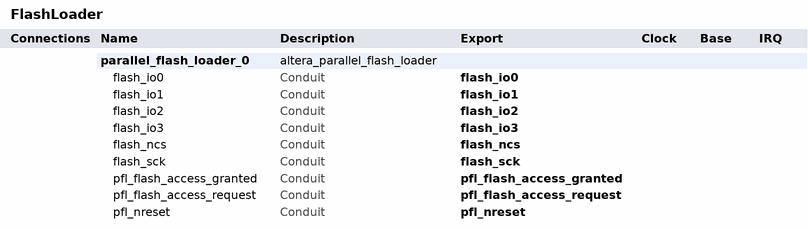
[diagram p0: system contents]
# Platform Designer (Qsys) system FlashLoader, MAX 10 10M04SCE144C8G
# Parameters at their usual value, and those the tool derives, are not listed.
package require -exact qsys 15.0
create_system FlashLoader
set_project_property DEVICE_FAMILY {MAX 10}
set_project_property DEVICE 10M04SCE144C8G

add_instance parallel_flash_loader_0 altera_parallel_flash_loader 15.0
set_instance_property parallel_flash_loader_0 AUTO_EXPORT true
set_instance_parameter_value parallel_flash_loader_0 FLASH_ECC_CHECKBOX false
set_instance_parameter_value parallel_flash_loader_0 QFLASH_FAST_SPEED false
set_instance_parameter_value parallel_flash_loader_0 TRISTATE_CHECKBOX false
set_instance_parameter_value parallel_flash_loader_0 clock_frequency 100.0
set_instance_parameter_value parallel_flash_loader_0 dclk_divisor_combo 1
set_instance_parameter_value parallel_flash_loader_0 decompressor_combo None
set_instance_parameter_value parallel_flash_loader_0 disable_crc_check true
set_instance_parameter_value parallel_flash_loader_0 enhanced_flash_programming_combo Area
set_instance_parameter_value parallel_flash_loader_0 fifo_size_combo 16
set_instance_parameter_value parallel_flash_loader_0 flash_access_time 100
set_instance_parameter_value parallel_flash_loader_0 flash_data_width_combo {16 bits}
set_instance_parameter_value parallel_flash_loader_0 flash_device_combo {CFI 8 Mbit}
set_instance_parameter_value parallel_flash_loader_0 flash_nreset_check false
set_instance_parameter_value parallel_flash_loader_0 flash_type_combo {Quad SPI Flash}
set_instance_parameter_value parallel_flash_loader_0 fpga_conf_scheme_combo {PS (passive serial)}
set_instance_parameter_value parallel_flash_loader_0 nflash_access_time 100
set_instance_parameter_value parallel_flash_loader_0 nflash_data_width_combo {8 bits}
set_instance_parameter_value parallel_flash_loader_0 nflash_device_combo {NAND 512 Mbit}
set_instance_parameter_value parallel_flash_loader_0 nflash_mfc_combo {Micron(NAND)}
set_instance_parameter_value parallel_flash_loader_0 nflash_rb_edit 0
set_instance_parameter_value parallel_flash_loader_0 num_flash_combo 1
set_instance_parameter_value parallel_flash_loader_0 num_nflash_combo 1
set_instance_parameter_value parallel_flash_loader_0 num_qflash_combo 1
set_instance_parameter_value parallel_flash_loader_0 operating_mode_combo {Flash Programming}
set_instance_parameter_value parallel_flash_loader_0 option_bit_address 0
set_instance_parameter_value parallel_flash_loader_0 qflash_mfc_combo Micron
set_instance_parameter_value parallel_flash_loader_0 qflash_size_combo {EPCQ 16 Mbit}
set_instance_parameter_value parallel_flash_loader_0 qspi_size_combo {QSPI 32 Mbit}
set_instance_parameter_value parallel_flash_loader_0 read_modes_combo {Normal Mode}
set_instance_parameter_value parallel_flash_loader_0 reconfigure_checkbox false
set_instance_parameter_value parallel_flash_loader_0 rsu_watchdog_checkbox false
set_instance_parameter_value parallel_flash_loader_0 rsu_watchdog_counter_edit 100.0
set_instance_parameter_value parallel_flash_loader_0 safe_mode_combo Halt
set_instance_parameter_value parallel_flash_loader_0 safe_mode_revert_edit 0

# exported interfaces
add_interface flash_io0 conduit end
set_interface_property flash_io0 EXPORT_OF parallel_flash_loader_0.flash_io0
add_interface flash_io1 conduit end
set_interface_property flash_io1 EXPORT_OF parallel_flash_loader_0.flash_io1
add_interface flash_io2 conduit end
set_interface_property flash_io2 EXPORT_OF parallel_flash_loader_0.flash_io2
add_interface flash_io3 conduit end
set_interface_property flash_io3 EXPORT_OF parallel_flash_loader_0.flash_io3
add_interface flash_ncs conduit end
set_interface_property flash_ncs EXPORT_OF parallel_flash_loader_0.flash_ncs
add_interface flash_sck conduit end
set_interface_property flash_sck EXPORT_OF parallel_flash_loader_0.flash_sck
add_interface pfl_flash_access_granted conduit end
set_interface_property pfl_flash_access_granted EXPORT_OF parallel_flash_loader_0.pfl_flash_access_granted
add_interface pfl_flash_access_request conduit end
set_interface_property pfl_flash_access_request EXPORT_OF parallel_flash_loader_0.pfl_flash_access_request
add_interface pfl_nreset conduit end
set_interface_property pfl_nreset EXPORT_OF parallel_flash_loader_0.pfl_nreset

set_interconnect_requirement {$system} qsys_mm.clockCrossingAdapter HANDSHAKE
set_interconnect_requirement {$system} qsys_mm.enableEccProtection FALSE
set_interconnect_requirement {$system} qsys_mm.insertDefaultSlave FALSE
set_interconnect_requirement {$system} qsys_mm.maxAdditionalLatency 1

save_system FlashLoader.qsys
